# Altium schematic sheet LED_Controller_Connectors.SchDoc
size A4; Organization: ENEL429 Group N; Address1: ECE Department; Address2: University of Canterbury; Address3: Christchurch 8041; Address4: New Zealand; Revision: 1
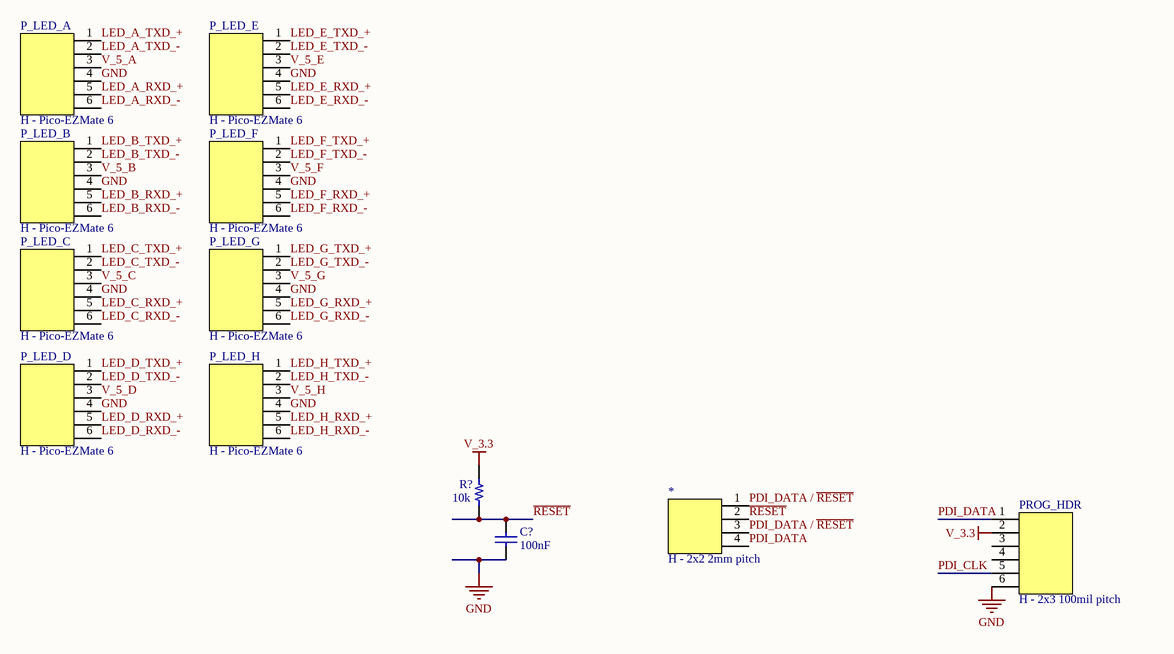
[diagram p0: LED_Controller_Connectors.SchDoc]

## Parts
*  H - 2x2 2mm pitch
C?  100nF  [0603]
P_LED_A  H - Pico-EZMate 6  [Molex - 78171-6006]
P_LED_B  H - Pico-EZMate 6  [Molex - 78171-6006]
P_LED_C  H - Pico-EZMate 6  [Molex - 78171-6006]
P_LED_D  H - Pico-EZMate 6  [Molex - 78171-6006]
P_LED_E  H - Pico-EZMate 6  [Molex - 78171-6006]
P_LED_F  H - Pico-EZMate 6  [Molex - 78171-6006]
P_LED_G  H - Pico-EZMate 6  [Molex - 78171-6006]
P_LED_H  H - Pico-EZMate 6  [Molex - 78171-6006]
PROG_HDR  H - 2x3 100mil pitch  [75869-131LF]
R?  10k  [0603]

## Nets
GND: C?.2 P_LED_A.4 P_LED_B.4 P_LED_C.4 P_LED_D.4 P_LED_E.4 P_LED_F.4 P_LED_G.4 P_LED_H.4 PROG_HDR.6
V_3.3: PROG_HDR.2 R?.2
LED_A_RXD_+: P_LED_A.5
LED_A_RXD_-: P_LED_A.6
LED_A_TXD_+: P_LED_A.1
LED_A_TXD_-: P_LED_A.2
LED_B_RXD_+: P_LED_B.5
LED_B_RXD_-: P_LED_B.6
LED_B_TXD_+: P_LED_B.1
LED_B_TXD_-: P_LED_B.2
LED_C_RXD_+: P_LED_C.5
LED_C_RXD_-: P_LED_C.6
LED_C_TXD_+: P_LED_C.1
LED_C_TXD_-: P_LED_C.2
LED_D_RXD_+: P_LED_D.5
LED_D_RXD_-: P_LED_D.6
LED_D_TXD_+: P_LED_D.1
LED_D_TXD_-: P_LED_D.2
LED_E_RXD_+: P_LED_E.5
LED_E_RXD_-: P_LED_E.6
LED_E_TXD_+: P_LED_E.1
LED_E_TXD_-: P_LED_E.2
LED_F_RXD_+: P_LED_F.5
LED_F_RXD_-: P_LED_F.6
LED_F_TXD_+: P_LED_F.1
LED_F_TXD_-: P_LED_F.2
LED_G_RXD_+: P_LED_G.5
LED_G_RXD_-: P_LED_G.6
LED_G_TXD_+: P_LED_G.1
LED_G_TXD_-: P_LED_G.2
LED_H_RXD_+: P_LED_H.5
LED_H_RXD_-: P_LED_H.6
LED_H_TXD_+: P_LED_H.1
LED_H_TXD_-: P_LED_H.2
PDI_CLK: PROG_HDR.5
PDI_DATA: *.4 PROG_HDR.1
PDI_DATA / ~{RESET}: *.1 *.3
~{RESET}: *.2 C?.1 R?.1
V_5_A: P_LED_A.3
V_5_B: P_LED_B.3
V_5_C: P_LED_C.3
V_5_D: P_LED_D.3
V_5_E: P_LED_E.3
V_5_F: P_LED_F.3
V_5_G: P_LED_G.3
V_5_H: P_LED_H.3

Not connected (* = marked no-connect by the designer): PROG_HDR 3 4

## Notes on the sheet
- Title
- Drawn by:
- Date:
- Time:
- Revision:
- Sheet
- of
- File:

## Library data of the parts
C? = CP - 100nF 0603: CAP CER .10UF 50V X5R 0603; Manufacturer: AVX Corporation; Manufacturer Part Number: 06035D104KAT2A; Capacitance: 0.1µF; Tolerance: ±10%; Supplier 1: Digi-Key; RoHS: RoHS Compliant; Category: Capacitors; Stock 1: 0; Pricing 1: 10=0.33, 100=0.195, 500=0.1125, 1000=0.078 (USD); Voltage - Rated: 50V; Temperature Coefficient: X5R; Mounting Type: Surface Mount, MLCC; Operating Temperature: -55°C ~ 85°C; Applications: General Purpose; Ratings: -; Package / Case: 0603 (1608 Metric); Size / Dimension: 0.063" L x 0.032" W (1.60mm x 0.81mm); Height: -; Thickness: 0.035" (0.90mm); Lead Spacing: -; Features: -; Packaging: Cut Tape (CT); Lead Style: -; ComponentLink1URL: http://www.avx.com/docs/Catalogs/cx5r.pdf; ComponentLink1Description: http://www.avx.com/docs/Catalogs/cx5r.pdf; Supplier Part Number 1: 478-6206-1-ND
P_LED_A P_LED_B P_LED_C P_LED_D P_LED_E P_LED_F P_LED_G P_LED_H = H - Pico-EZMate 6: CONN HEADER 6POS 1.20MM R/A SMD; Supplier 1: Digi-Key; Supplier Part Number 1: WM5408CT-ND
PROG_HDR = H - 2x3 100mil pitch: CONN HEADER 6POS DUAL VERT PCB; Manufacturer: FCI; Connector Type: Header, Shrouded; Number of Positions: 6; Number of Positions Loaded: All; Pitch: 0.100" (2.54mm); Manufacturer Part Number: 75869-131LF; RoHS: RoHS Compliant; Category: Connectors, Interconnects; Contact Type: Male Pin; Number of Rows: 2; Row Spacing: 0.100" (2.54mm); Contact Mating Length: 0.236" (6.00mm); Mounting Type: Through Hole; Termination: Solder; Fastening Type: -; Features: -; Contact Finish: Gold, GXT™; Contact Finish Thickness: 30µin (0.76µm); Color: Blue; Packaging: Tube; ComponentLink1URL: http://portal.fciconnect.com/res/en/pdffiles/doc_search/75869.pdf; ComponentLink1Description: http://portal.fciconnect.com/res/en/pdffiles/doc_search/75869.pdf; Supplier 1: Digi-Key; Supplier Part Number 1: 609-2845-ND
R? = RS - 10k 0603: RES 10.0K OHM 1/10W 1% 0603 SMD; Manufacturer: Yageo; Manufacturer Part Number: RC0603FR-0710KL; Power (Watts): 0.1W, 1/10W; Temperature Coefficient: ±100ppm/°C; Supplier 1: Digi-Key; RoHS: RoHS Compliant; Category: Resistors; Stock 1: 9813840; Pricing 1: 10=0.014, 50=0.0104, 100=0.0079, 250=0.00584, 500=0.00432, 1000=0.00288 (USD); Resistance (Ohms): 10K; Composition: Thick Film; Features: -; Tolerance: ±1%; Size / Dimension: 0.063" L x 0.031" W (1.60mm x 0.80mm); Height: 0.022" (0.55mm); Number of Terminations: 2; Packaging: Cut Tape (CT); Package / Case: 0603 (1608 Metric); ComponentLink1URL: http://www.yageo.com/documents/recent/PYu-RC0603_51_RoHS_L_4.pdf; ComponentLink1Description: http://www.yageo.com/documents/recent/PYu-RC0603_51_RoHS_L_4.pdf; Supplier Part Number 1: 311-10.0KHRCT-ND
* = H - 2x2 2mm pitch: Supplier 1: Digi-Key; Supplier Part Number 1: WM18712-ND